# EAGLE design PR04 (EAGLE 6.6.0)
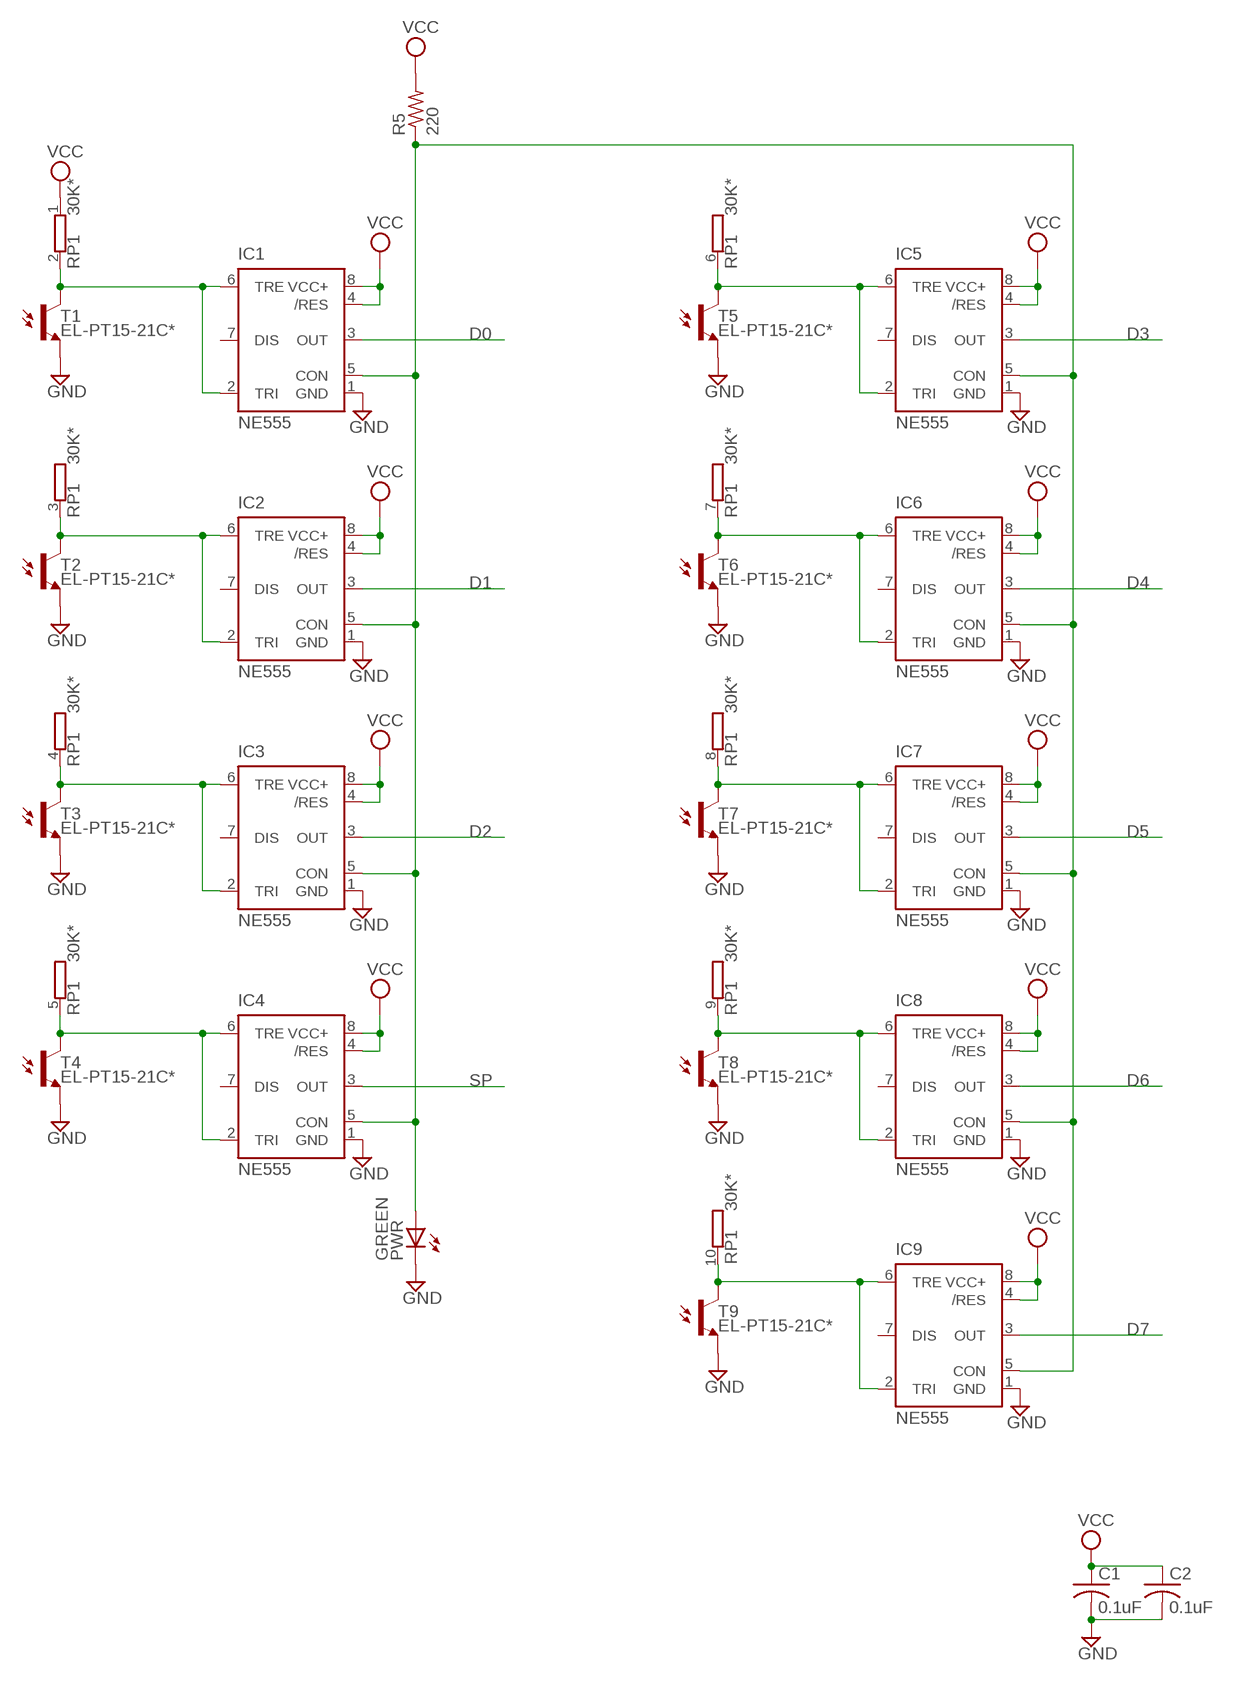
[diagram p0: schematic, sheet 1, part 1 of 2]
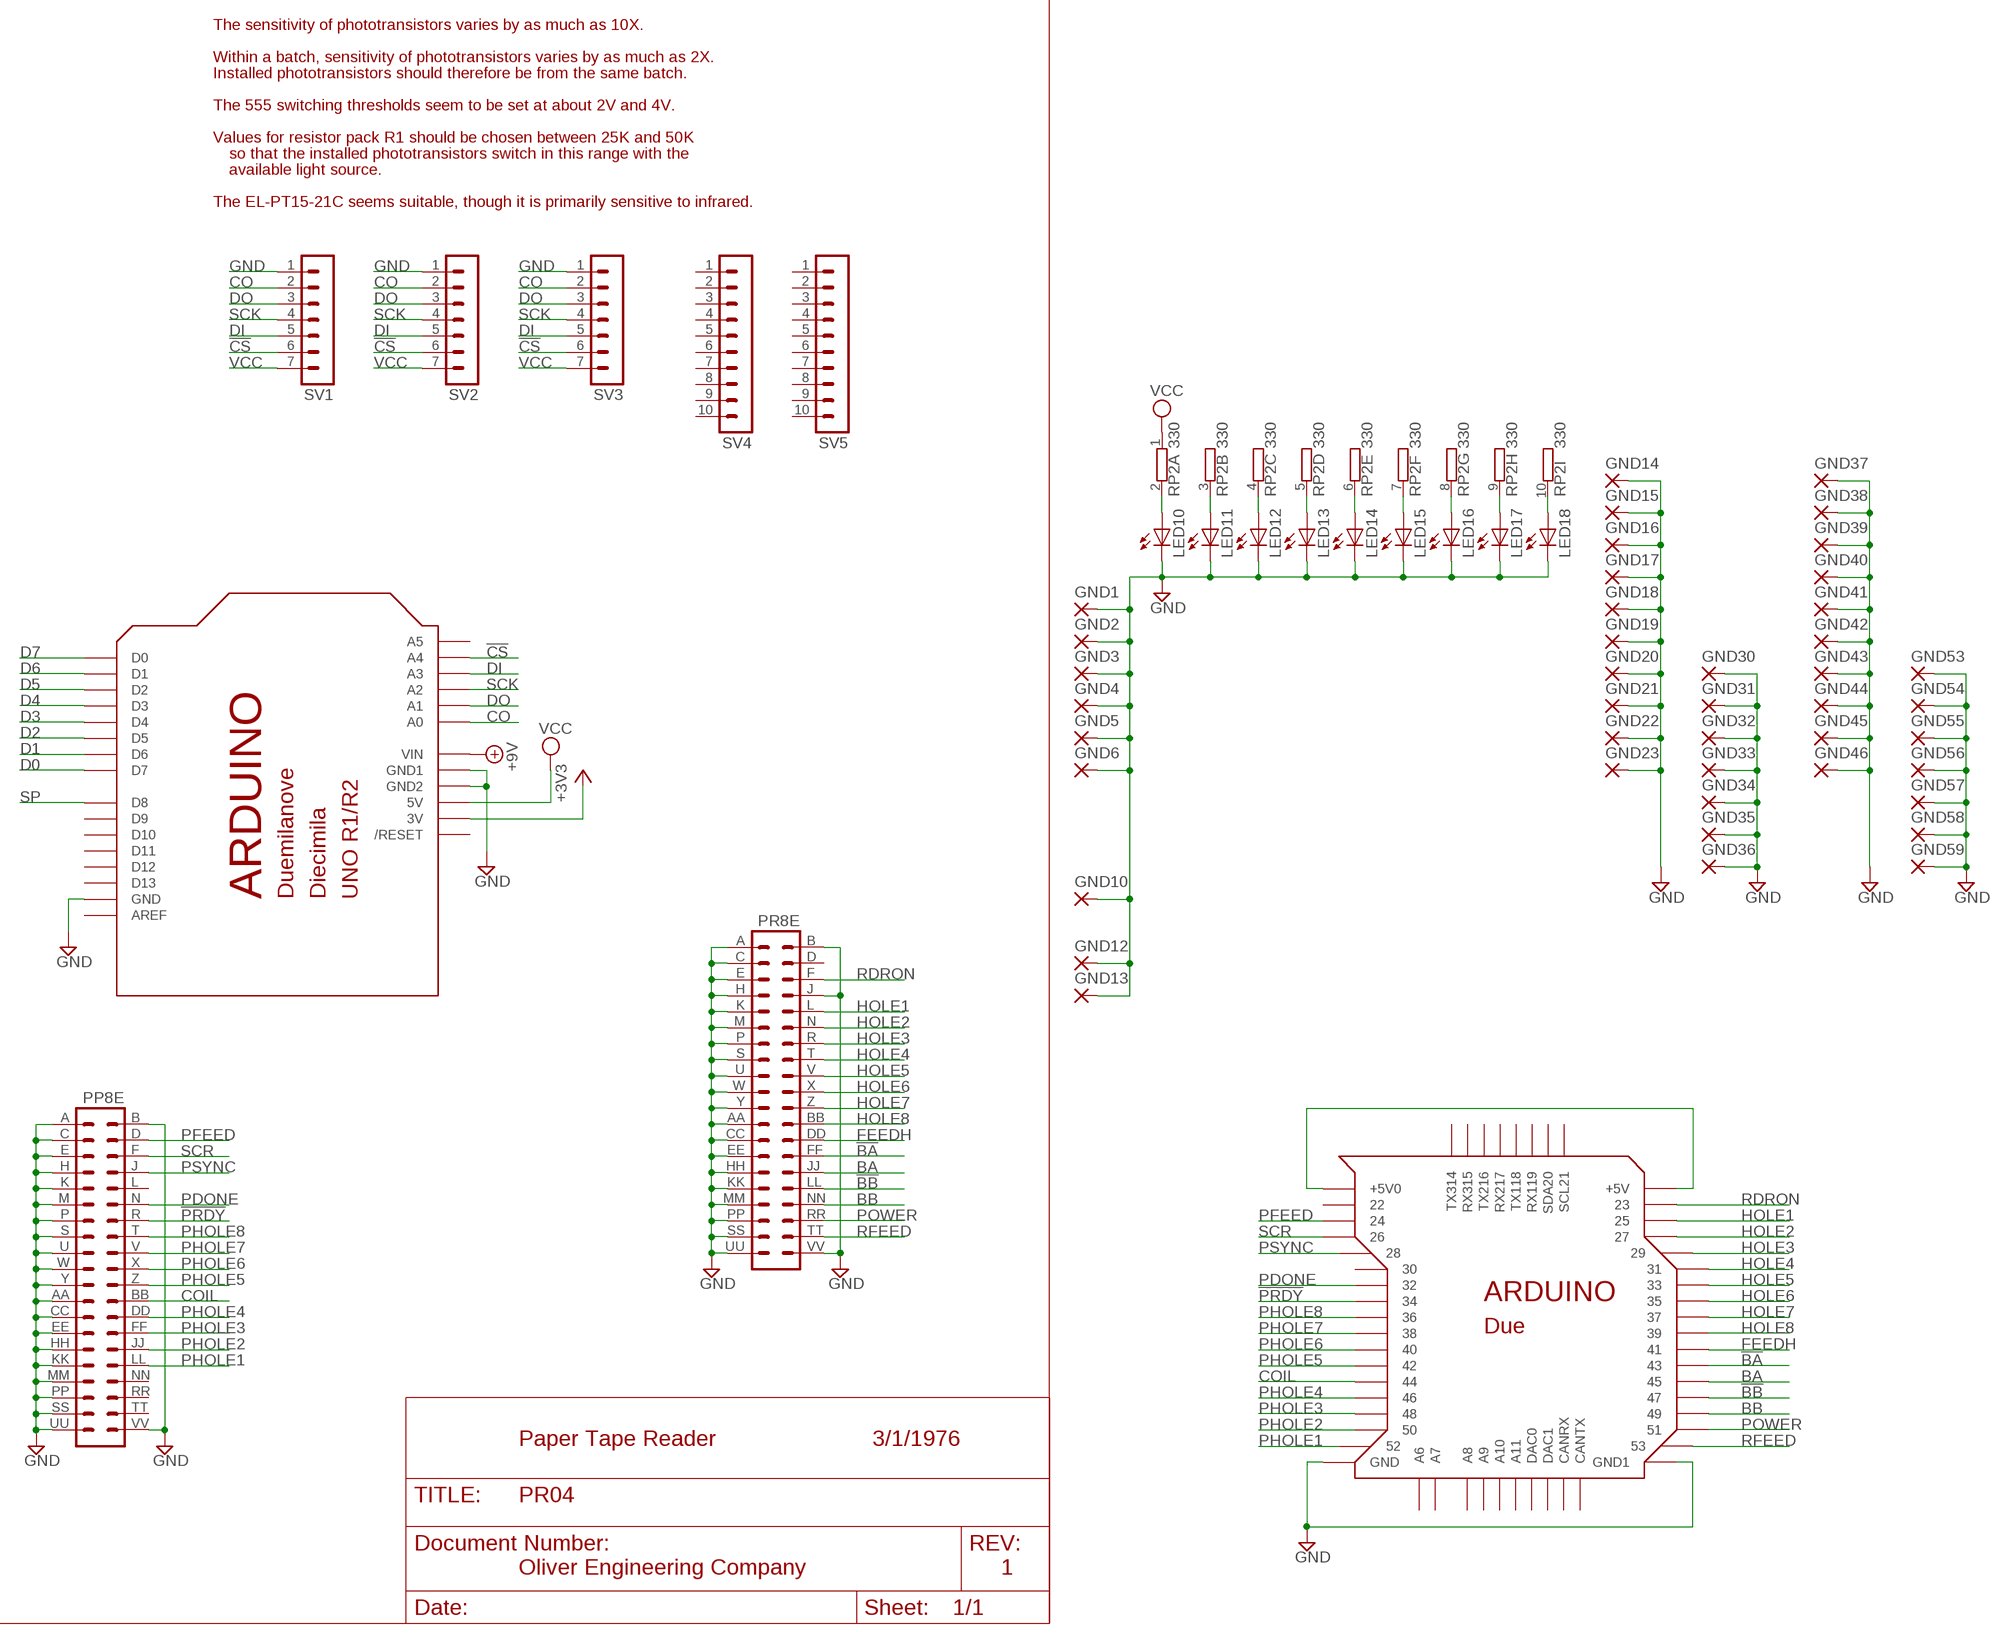
[diagram p1: schematic, sheet 1, part 2 of 2]

## Parts
C1  0.1uF  C-US050-030X075  [C050-030X075]
C2  0.1uF  C-US050-030X075  [C050-030X075]
GND1  2,15/1,0  [2,15/1,0]
GND2  2,15/1,0  [2,15/1,0]
GND3  2,15/1,0  [2,15/1,0]
GND4  2,15/1,0  [2,15/1,0]
GND5  2,15/1,0  [2,15/1,0]
GND6  2,15/1,0  [2,15/1,0]
GND10  2,15/1,0  [2,15/1,0]
GND12  2,15/1,0  [2,15/1,0]
GND13  2,15/1,0  [2,15/1,0]
GND14  2,15/1,0  [2,15/1,0]
GND15  2,15/1,0  [2,15/1,0]
GND16  2,15/1,0  [2,15/1,0]
GND17  2,15/1,0  [2,15/1,0]
GND18  2,15/1,0  [2,15/1,0]
GND19  2,15/1,0  [2,15/1,0]
GND20  2,15/1,0  [2,15/1,0]
GND21  2,15/1,0  [2,15/1,0]
GND22  2,15/1,0  [2,15/1,0]
GND23  2,15/1,0  [2,15/1,0]
GND30  2,15/1,0  [2,15/1,0]
GND31  2,15/1,0  [2,15/1,0]
GND32  2,15/1,0  [2,15/1,0]
GND33  2,15/1,0  [2,15/1,0]
GND34  2,15/1,0  [2,15/1,0]
GND35  2,15/1,0  [2,15/1,0]
GND36  2,15/1,0  [2,15/1,0]
GND37  2,15/1,0  [2,15/1,0]
GND38  2,15/1,0  [2,15/1,0]
GND39  2,15/1,0  [2,15/1,0]
GND40  2,15/1,0  [2,15/1,0]
GND41  2,15/1,0  [2,15/1,0]
GND42  2,15/1,0  [2,15/1,0]
GND43  2,15/1,0  [2,15/1,0]
GND44  2,15/1,0  [2,15/1,0]
GND45  2,15/1,0  [2,15/1,0]
GND46  2,15/1,0  [2,15/1,0]
GND53  2,15/1,0  [2,15/1,0]
GND54  2,15/1,0  [2,15/1,0]
GND55  2,15/1,0  [2,15/1,0]
GND56  2,15/1,0  [2,15/1,0]
GND57  2,15/1,0  [2,15/1,0]
GND58  2,15/1,0  [2,15/1,0]
GND59  2,15/1,0  [2,15/1,0]
IC1  NE555  [DIL-08]
IC2  NE555  [DIL-08]
IC3  NE555  [DIL-08]
IC4  NE555  [DIL-08]
IC5  NE555  [DIL-08]
IC6  NE555  [DIL-08]
IC7  NE555  [DIL-08]
IC8  NE555  [DIL-08]
IC9  NE555  [DIL-08]
LED10  LEDCHIPLED_1206  [CHIPLED_1206]
LED11  LEDCHIPLED_1206  [CHIPLED_1206]
LED12  LEDCHIPLED_1206  [CHIPLED_1206]
LED13  LEDCHIPLED_1206  [CHIPLED_1206]
LED14  LEDCHIPLED_1206  [CHIPLED_1206]
LED15  LEDCHIPLED_1206  [CHIPLED_1206]
LED16  LEDCHIPLED_1206  [CHIPLED_1206]
LED17  LEDCHIPLED_1206  [CHIPLED_1206]
LED18  LEDCHIPLED_1206  [CHIPLED_1206]
PP8E  DEC40PINV  [DEC40PINV]
PR8E  DEC40PINV  [DEC40PINV]
PWR  GREEN  LED3MM  [LED3MM]
R5  220  R-US_0207/10  [0207/10]
RP1  30K*  GE09RP  [SIL10]
RP2  330  GE09R  [SIL10]
SV1  MA07-1  [MA07-1]
SV2  MA07-1  [MA07-1]
SV3  MA07-1  [MA07-1]
SV4  MA10-1  [MA10-1]
SV5  MA10-1  [MA10-1]
T1  EL-PT15-21C*  PHOTOTRANSISTOR  [CHIPLED_1206]
T2  EL-PT15-21C*  PHOTOTRANSISTOR  [CHIPLED_1206]
T3  EL-PT15-21C*  PHOTOTRANSISTOR  [CHIPLED_1206]
T4  EL-PT15-21C*  PHOTOTRANSISTOR  [CHIPLED_1206]
T5  EL-PT15-21C*  PHOTOTRANSISTOR  [CHIPLED_1206]
T6  EL-PT15-21C*  PHOTOTRANSISTOR  [CHIPLED_1206]
T7  EL-PT15-21C*  PHOTOTRANSISTOR  [CHIPLED_1206]
T8  EL-PT15-21C*  PHOTOTRANSISTOR  [CHIPLED_1206]
T9  EL-PT15-21C*  PHOTOTRANSISTOR  [CHIPLED_1206]
U$2  ARDUINO-X  [ARDUINO_DUE_SHIELD]

## Nets
!BA: PR8E.FF U$2.43
!BB: PR8E.LL U$2.47
!CS: SV1.6 SV2.6 SV3.6 U$2.A4
!PRDY: PP8E.R U$2.34
+3V3: U$2.3V3(3V)
+5V: U$2.5V0_1(+5V) U$2.5V0_2(+5V0)
+9V: U$2.VIN
BA: PR8E.JJ U$2.45
BB: PR8E.NN U$2.49
CO: SV1.2 SV2.2 SV3.2 U$2.A0
COIL: PP8E.BB U$2.44
D0: IC1.3(OUT) U$2.7(D7)
D1: IC2.3(OUT) U$2.6(D6)
D2: IC3.3(OUT) U$2.5(D5)
D3: IC5.3(OUT) U$2.4(D4)
D4: IC6.3(OUT) U$2.3(D3)
D5: IC7.3(OUT) U$2.2(D2)
D6: IC8.3(OUT) U$2.1(D1)
D7: IC9.3(OUT) U$2.0(D0)
DI: SV1.5 SV2.5 SV3.5 U$2.A3
DO: SV1.3 SV2.3 SV3.3 U$2.A1
FEEDH: PR8E.DD U$2.41
GND [supply]: C1.2 C2.2 GND1.1(P) GND2.1(P) GND3.1(P) GND4.1(P) GND5.1(P) GND6.1(P) GND10.1(P) GND12.1(P) GND13.1(P) GND14.1(P) GND15.1(P) GND16.1(P) GND17.1(P) GND18.1(P) GND19.1(P) GND20.1(P) GND21.1(P) GND22.1(P) GND23.1(P) GND30.1(P) GND31.1(P) GND32.1(P) GND33.1(P) GND34.1(P) GND35.1(P) GND36.1(P) GND37.1(P) GND38.1(P) GND39.1(P) GND40.1(P) GND41.1(P) GND42.1(P) GND43.1(P) GND44.1(P) GND45.1(P) GND46.1(P) GND53.1(P) GND54.1(P) GND55.1(P) GND56.1(P) GND57.1(P) GND58.1(P) GND59.1(P) IC1.1(GND) IC2.1(GND) IC3.1(GND) IC4.1(GND) IC5.1(GND) IC6.1(GND) IC7.1(GND) IC8.1(GND) IC9.1(GND) LED10.C LED11.C LED12.C LED13.C LED14.C LED15.C LED16.C LED17.C LED18.C PP8E.A PP8E.AA PP8E.B PP8E.C PP8E.CC PP8E.E PP8E.EE PP8E.H PP8E.HH PP8E.K PP8E.KK PP8E.M PP8E.MM PP8E.P PP8E.PP PP8E.S PP8E.SS PP8E.U PP8E.UU PP8E.VV PP8E.W PP8E.Y PR8E.A PR8E.AA PR8E.B PR8E.C PR8E.CC PR8E.E PR8E.EE PR8E.H PR8E.HH PR8E.J PR8E.K PR8E.KK PR8E.M PR8E.MM PR8E.P PR8E.PP PR8E.S PR8E.SS PR8E.U PR8E.UU PR8E.VV PR8E.W PR8E.Y PWR.K(C) SV1.1 SV2.1 SV3.1 T1.C(E) T2.C(E) T3.C(E) T4.C(E) T5.C(E) T6.C(E) T7.C(E) T8.C(E) T9.C(E) U$2.GND U$2.GND_1(GND1) U$2.GND_2(GND2) U$2.GND_3(GND) U$2.GND_4(GND1)
HOLE1: PR8E.L U$2.25
HOLE2: PR8E.N U$2.27
HOLE3: PR8E.R U$2.29
HOLE4: PR8E.T U$2.31
HOLE5: PR8E.V U$2.33
HOLE6: PR8E.X U$2.35
HOLE7: PR8E.Z U$2.37
HOLE8: PR8E.BB U$2.39
N$1: IC1.2(TRI) IC1.6(TRE) RP1.2 T1.A(C)
N$3: IC1.5(CON) IC2.5(CON) IC3.5(CON) IC4.5(CON) IC5.5(CON) IC6.5(CON) IC7.5(CON) IC8.5(CON) IC9.5(CON) PWR.A R5.1
N$4: IC2.2(TRI) IC2.6(TRE) RP1.3 T2.A(C)
N$7: IC3.2(TRI) IC3.6(TRE) RP1.4 T3.A(C)
N$9: IC9.2(TRI) IC9.6(TRE) RP1.10 T9.A(C)
N$10: IC4.2(TRI) IC4.6(TRE) RP1.5 T4.A(C)
N$12: LED10.A RP2.2
N$13: IC5.2(TRI) IC5.6(TRE) RP1.6 T5.A(C)
N$14: LED13.A RP2.5
N$15: IC6.2(TRI) IC6.6(TRE) RP1.7 T6.A(C)
N$17: IC7.2(TRI) IC7.6(TRE) RP1.8 T7.A(C)
N$19: IC8.2(TRI) IC8.6(TRE) RP1.9 T8.A(C)
N$32: LED16.A RP2.8
N$33: LED18.A RP2.10
N$36: LED17.A RP2.9
N$37: LED15.A RP2.7
N$38: LED14.A RP2.6
N$39: LED12.A RP2.4
N$40: LED11.A RP2.3
PDONE: PP8E.N U$2.32
PFEED: PP8E.D U$2.24
PHOLE1: PP8E.LL U$2.52
PHOLE2: PP8E.JJ U$2.50
PHOLE3: PP8E.FF U$2.48
PHOLE4: PP8E.DD U$2.46
PHOLE5: PP8E.Z U$2.42
PHOLE6: PP8E.X U$2.40
PHOLE7: PP8E.V U$2.38
PHOLE8: PP8E.T U$2.36
POWER: PR8E.RR U$2.51
PSYNC: PP8E.J U$2.28
RDRON: PR8E.F U$2.23
RFEED: PR8E.TT U$2.53
SCK: SV1.4 SV2.4 SV3.4 U$2.A2
SCR: PP8E.F U$2.26
SP: IC4.3(OUT) U$2.8(D8)
VCC [supply]: C1.1 C2.1 IC1.4(/RES) IC1.8(VCC+) IC2.4(/RES) IC2.8(VCC+) IC3.4(/RES) IC3.8(VCC+) IC4.4(/RES) IC4.8(VCC+) IC5.4(/RES) IC5.8(VCC+) IC6.4(/RES) IC6.8(VCC+) IC7.4(/RES) IC7.8(VCC+) IC8.4(/RES) IC8.8(VCC+) IC9.4(/RES) IC9.8(VCC+) R5.2 RP1.1 RP2.1 SV1.7 SV2.7 SV3.7 U$2.5V0(5V)
Unconnected: IC1.7(DIS) IC2.7(DIS) IC3.7(DIS) IC4.7(DIS) IC5.7(DIS) IC6.7(DIS) IC7.7(DIS) IC8.7(DIS) IC9.7(DIS) PP8E.L PP8E.NN PP8E.RR PP8E.TT PR8E.D SV4.1 SV4.2 SV4.3 SV4.4 SV4.5 SV4.6 SV4.7 SV4.8 SV4.9 SV4.10 SV5.1 SV5.2 SV5.3 SV5.4 SV5.5 SV5.6 SV5.7 SV5.8 SV5.9 SV5.10 U$2.9(D9) U$2.10(D10) U$2.11(D11) U$2.12(D12) U$2.13(D13) U$2.14(TX314) U$2.15(RX315) U$2.16(TX216) U$2.17(RX217) U$2.18(TX118) U$2.19(RX119) U$2.20(SDA20) U$2.21(SCL21) U$2.22 U$2.30 U$2.A5 U$2.A6 U$2.A7 U$2.A8 U$2.A9 U$2.A10 U$2.A11 U$2.AREF U$2.CANRX U$2.CANTX U$2.DAC0 U$2.DAC1 U$2.RESET(/RESET)

## Notes on the sheet
- The sensitivity of phototransistors varies by as much as 10X.
- Within a batch, sensitivity of phototransistors varies by as much as 2X.
- Installed phototransistors should therefore be from the same batch.
- The 555 switching thresholds seem to be set at about 2V and 4V.
- Values for resistor pack R1 should be chosen between 25K and 50K
- so that the installed phototransistors switch in this range with the
- available light source.
- The EL-PT15-21C seems suitable, though it is primarily sensitive to infrared.
- Paper Tape Reader | 3/1/1976
- Oliver Engineering Company | 1

## Library data of the parts
C1 C2 = rcl:C-US: CAPACITOR, American symbol
GND1-GND6 GND10 GND12-GND23 GND30-GND46 GND53-GND59 = wirepad:2,15/1,0: THROUGH-HOLE PAD
IC1-IC9 = st-microelectronics:NE555: General purpose bipolar Timer; MF: Arrow Electronics; MPN: NE555N; OC_FARNELL: 1467742; OC_NEWARK: 89K1486
LED10-LED18 = opto:LED: LED OSRAM: - CHIPLED LG R971, LG N971, LY N971, LG Q971, LY Q971, LO R971, LY R971 LH N974, LH R974 LS Q976, LO Q976, LY Q976 LO Q996 - Hyper CHIPLED LW Q18S LB Q993, LB Q99A, LB R99A - SideLED LS A670, LO A670, LY A670, LG A670, LP A670 LB A673, LV A673, LT A673, LW A673 LH A674 LY A675 LS A676, LA A676, LO A676, LY A676, LW A676 LS A679, LY A679, LG A679 - Hyper Micro SIDELED® LS Y876, LA Y876, LO Y876, LY Y876 LT Y87S - SmartLED LW L88C, LW L88S LB L89C, LB L89S, LG L890 LS L89K, LO L89K, LY L89K LS L896, LA L896, LO L896, LY L896 - TOPLED LS T670, LO T670, LY T670, LG T670, LP T670 LSG T670, LSP T670, LSY T670, LOP T670, LYG T670 LG T671, LOG T671, LSG T671 LB T673, LV T673, LT T673, LW T673 LH T674 LS T676, LA T676, LO T676, LY T676, LB T676, LH T676, LSB T676, LW T676 LB T67C, LV T67C, LT T67C, LS T67K, LO T67K, LY T67K, LW E67C LS E67B, LA E67B, LO E67B, LY E67B, LB E67C, LV E67C, LT E67C LW T67C LS T679, LY T679, LG T679 LS T770, LO T770, LY T770, LG T770, LP T770 LB T773, LV T773, LT T773, LW T773 LH T774 LS E675, LA E675, LY E675, LS T675 LS T776, LA T776, LO T776, LY T776, LB T776 LHGB T686 LT T68C, LB T68C - Hyper Mini TOPLED® LB M676 - Mini TOPLED Santana® LG M470 LS M47K, LO M47K, LY M47K Source: http://www.osram.convergy.de LUXEON: - LUMILED® LXK2-PW12-R00, LXK2-PW12-S00, LXK2-PW14-U00, LXK2-PW14-V00 LXK2-PM12-R00, LXK2-PM12-S00, LXK2-PM14-U00 LXK2-PE12-Q00, LXK2-PE12-R00, LXK2-PE12-S00, LXK2-PE14-T00, LXK2-PE14-U00 LXK2-PB12-K00, LXK2-PB12-L00, LXK2-PB12-M00, LXK2-PB14-N00, LXK2-PB14-P00, LXK2-PB14-Q00 LXK2-PR12-L00, LXK2-PR12-M00, LXK2-PR14-Q00, LXK2-PR14-R00 LXK2-PD12-Q00, LXK2-PD12-R00, LXK2-PD12-S00 LXK2-PH12-R00, LXK2-PH12-S00 LXK2-PL12-P00, LXK2-PL12-Q00, LXK2-PL12-R00 Source: www.luxeon.com KINGBRIGHT: KA-3528ASYC Source: www.kingbright.com
PP8E PR8E = dec-con:DEC40PIN: PIN HEADER
PWR = led:LED: LED OSRAM: - CHIPLED LG R971, LG N971, LY N971, LG Q971, LY Q971, LO R971, LY R971 LH N974, LH R974 LS Q976, LO Q976, LY Q976 LO Q996 - Hyper CHIPLED LW Q18S LB Q993, LB Q99A, LB R99A - SideLED LS A670, LO A670, LY A670, LG A670, LP A670 LB A673, LV A673, LT A673, LW A673 LH A674 LY A675 LS A676, LA A676, LO A676, LY A676, LW A676 LS A679, LY A679, LG A679 - Hyper Micro SIDELED® LS Y876, LA Y876, LO Y876, LY Y876 LT Y87S - SmartLED LW L88C, LW L88S LB L89C, LB L89S, LG L890 LS L89K, LO L89K, LY L89K LS L896, LA L896, LO L896, LY L896 - TOPLED LS T670, LO T670, LY T670, LG T670, LP T670 LSG T670, LSP T670, LSY T670, LOP T670, LYG T670 LG T671, LOG T671, LSG T671 LB T673, LV T673, LT T673, LW T673 LH T674 LS T676, LA T676, LO T676, LY T676, LB T676, LH T676, LSB T676, LW T676 LB T67C, LV T67C, LT T67C, LS T67K, LO T67K, LY T67K, LW E67C LS E67B, LA E67B, LO E67B, LY E67B, LB E67C, LV E67C, LT E67C LW T67C LS T679, LY T679, LG T679 LS T770, LO T770, LY T770, LG T770, LP T770 LB T773, LV T773, LT T773, LW T773 LH T774 LS E675, LA E675, LY E675, LS T675 LS T776, LA T776, LO T776, LY T776, LB T776 LHGB T686 LT T68C, LB T68C - Hyper Mini TOPLED® LB M676 - Mini TOPLED Santana® LG M470 LS M47K, LO M47K, LY M47K Source: http://www.osram.convergy.de LUXEON: - LUMILED® LXK2-PW12-R00, LXK2-PW12-S00, LXK2-PW14-U00, LXK2-PW14-V00 LXK2-PM12-R00, LXK2-PM12-S00, LXK2-PM14-U00 LXK2-PE12-Q00, LXK2-PE12-R00, LXK2-PE12-S00, LXK2-PE14-T00, LXK2-PE14-U00 LXK2-PB12-K00, LXK2-PB12-L00, LXK2-PB12-M00, LXK2-PB14-N00, LXK2-PB14-P00, LXK2-PB14-Q00 LXK2-PR12-L00, LXK2-PR12-M00, LXK2-PR14-Q00, LXK2-PR14-R00 LXK2-PD12-Q00, LXK2-PD12-R00, LXK2-PD12-S00 LXK2-PH12-R00, LXK2-PH12-S00 LXK2-PL12-P00, LXK2-PL12-Q00, LXK2-PL12-R00 Source: www.luxeon.com KINGBRIGHT: KA-3528ASYC Source: www.kingbright.com
R5 = rcl:R-US_: RESISTOR, American symbol
RP1 = resistor-sil:GE09RP: SIL RESISTOR; OC_FARNELL: unknown; OC_NEWARK: unknown
RP2 = resistor-sil:GE09R: SIL RESISTOR; OC_FARNELL: unknown; OC_NEWARK: unknown
SV1-SV3 = con-lstb:MA07-1: PIN HEADER; OC_FARNELL: unknown; OC_NEWARK: unknown
SV4 SV5 = con-lstb:MA10-1: PIN HEADER; OC_FARNELL: unknown; OC_NEWARK: unknown
T1-T9 = opto:PHOTOTRANSISTOR: Phototransistor PT17-21C/L41/TR8 is a phototransistor in miniature SMD package which is molded in a water clear with flat top view lens. The device is Spectrally matched to visible and infrared emitting diode. Datasheet <http://www.everlight.com/file/ProductFile/PT17-21C-L41-TR8.pdf> SparkFun Products: SparkFun Electric Imp imp002 Breakout <https://www.sparkfun.com/products/12958>
U$2 = arduino:ARDUINO-X: Extended Body Arduino

## Net classes
1 supply: width 0.61 mm

## Board
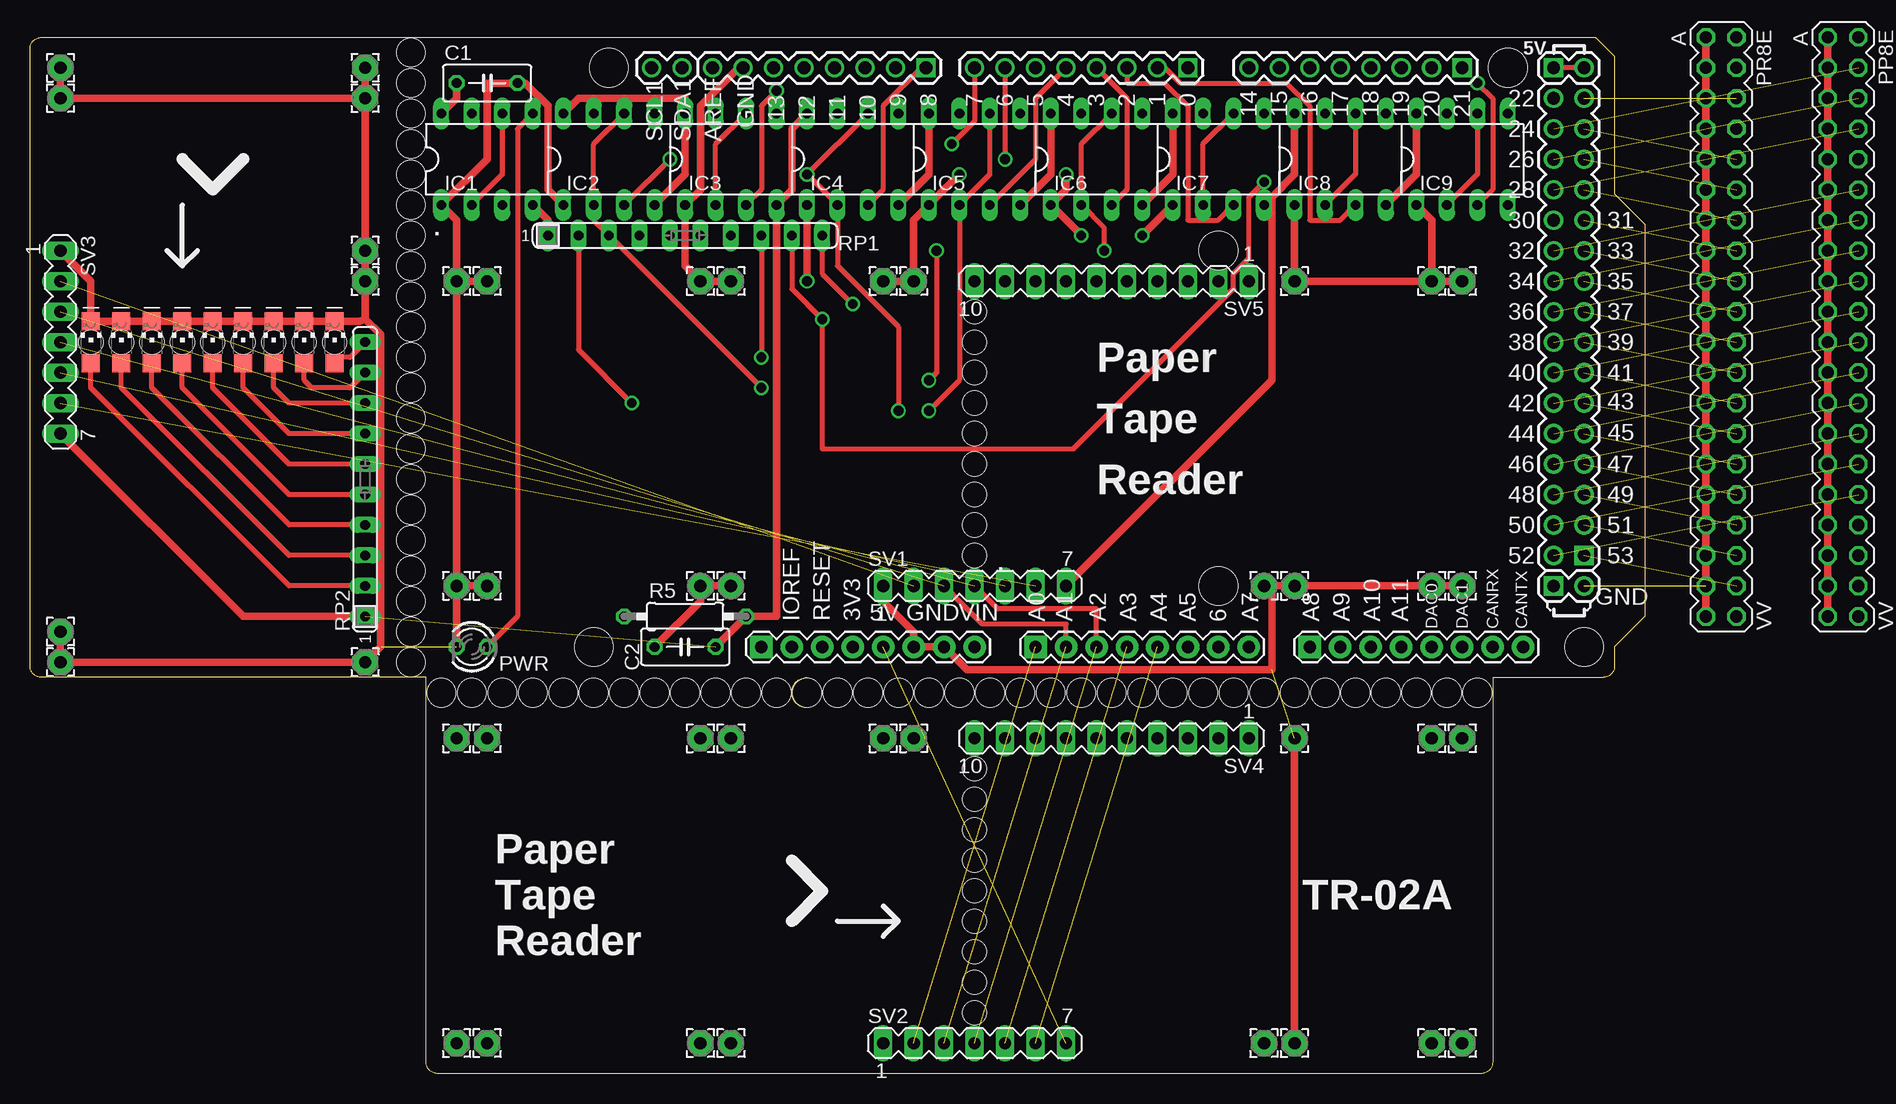
[diagram p2: board, top side]
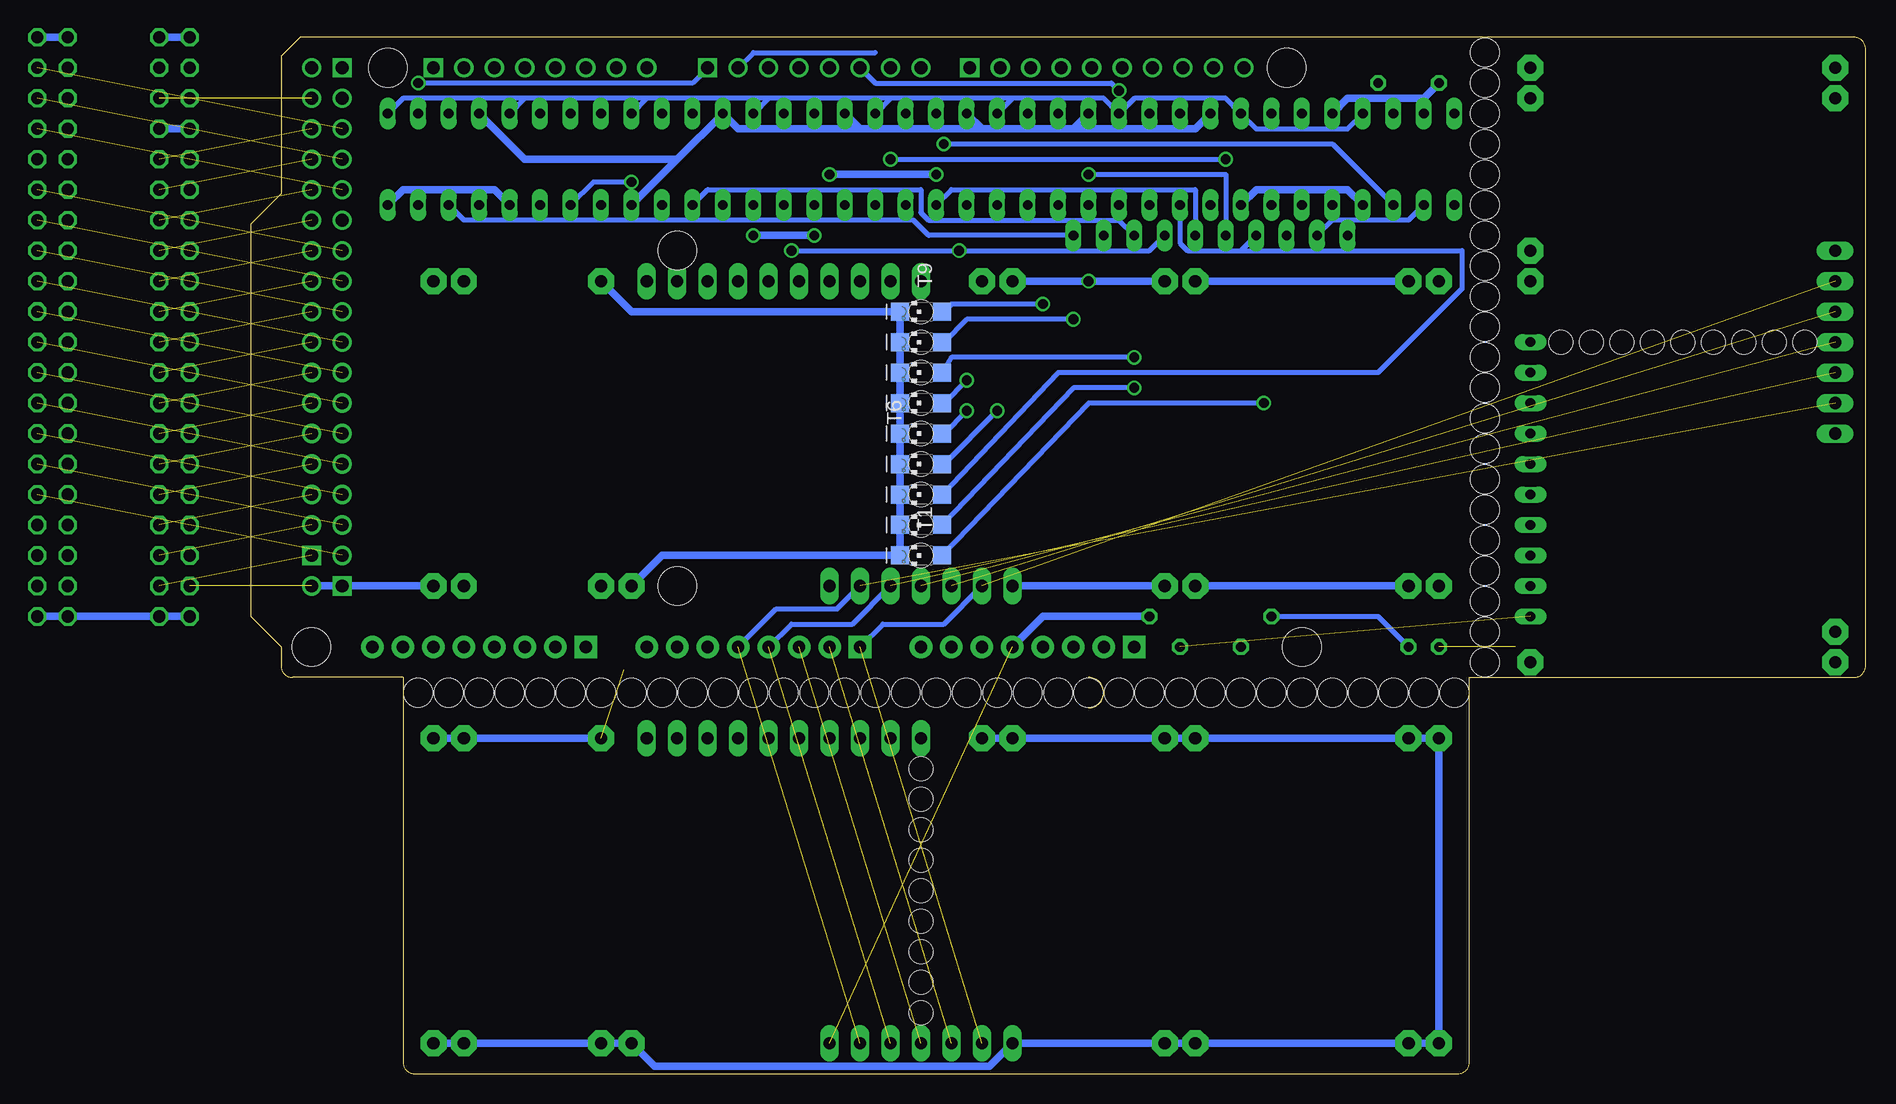
[diagram p3: board, bottom side, seen from below]

Size 134.62 x 86.36 mm. Coordinates in mm from the lower left corner, seen from the top.
Outline: 64.77,30.48 arc-180 64.77,33.02
Outline: 33.02,33.02 0.95,33.02 arc-90 0,33.97 0,85.41 arc-90 0.95,86.36 130.49,86.36 132.08,84.77 132.08,73.34 134.62,70.8 134.62,38.1 132.08,35.56 132.08,33.97 arc-90 131.13,33.02 121.92,33.02 121.92,0.95 arc-90 120.97,0 33.97,0 arc-90 33.02,0.95 33.02,33.02
Copper layers (1+16): Top 0.035mm / dielectric 1.5mm / Bottom 0.035mm
Design rules "16mils *": minimum track width 16mil, minimum drill 32mil, track to track 15mil, track to pad 10mil, pad to pad 10mil, via to via 10mil, smd to smd 10mil, copper to edge 0mil, drill to drill 6mil, minimum pad ring 10mil, minimum via ring 8mil, stop-mask expansion 0mil, vias tented up to drill 0mil, thermal gap 10mil
Holes 2 mm at 25.4,60.96 22.86,60.96 20.32,60.96 17.78,60.96 15.24,60.96 12.7,60.96 10.16,60.96 7.62,60.96 5.08,60.96 78.74,5.08 78.74,7.62 78.74,10.16 78.74,12.7 78.74,15.24 78.74,17.78 78.74,20.32 78.74,22.86 78.74,25.4 78.74,43.18 78.74,45.72 78.74,48.26 78.74,50.8 78.74,53.34 78.74,55.88 78.74,58.42 78.74,60.96 78.74,63.5
Holes 2.38 mm at 31.75,34.29 31.75,36.83 31.75,39.37 31.75,41.91 31.75,44.45 31.75,46.99 31.75,49.53 31.75,52.07 31.75,54.61 31.75,57.15 31.75,59.69 31.75,85.09 31.75,82.55 31.75,80.01 31.75,77.47 31.75,74.93 31.75,72.39 31.75,69.85 31.75,67.31 31.75,64.77 31.75,62.23 85.09,31.75 82.55,31.75 80.01,31.75 77.47,31.75 74.93,31.75 72.39,31.75 69.85,31.75 67.31,31.75 64.77,31.75 62.23,31.75 59.69,31.75 34.29,31.75 36.83,31.75 39.37,31.75 41.91,31.75 44.45,31.75 46.99,31.75 49.53,31.75 52.07,31.75 54.61,31.75 57.15,31.75 120.65,31.75 118.11,31.75 115.57,31.75 113.03,31.75 87.63,31.75 90.17,31.75 92.71,31.75 95.25,31.75 97.79,31.75 100.33,31.75 102.87,31.75 105.41,31.75 107.95,31.75 110.49,31.75

### Footprints (pad centres in the part's own frame; a part is rotated, then mirrored left to right if it is on the bottom)
C050-030X075 = drill 0.813 octagon: 1 -2.54,0; 2 2.54,0
2,15/1,0 = drill 1.016 pad 2.159 octagon: 1 0,0
DIL-08 = drill 0.813 long: 1 -3.81,-3.81; 2 -1.27,-3.81; 3 1.27,-3.81; 4 3.81,-3.81; 5 3.81,3.81; 6 1.27,3.81; 7 -1.27,3.81; 8 -3.81,3.81
CHIPLED_1206 = smd 1.5 x 1.5: A 0,-1.75; C 0,1.75
DEC40PINV = drill 1.016 octagon: A -24.13,-1.27; AA 3.81,-1.27; B -24.13,1.27; BB 3.81,1.27; C -21.59,-1.27; CC 6.35,-1.27; D -21.59,1.27; DD 6.35,1.27; E -19.05,-1.27; EE 8.89,-1.27; F -19.05,1.27; FF 8.89,1.27; H -16.51,-1.27; HH 11.43,-1.27; J -16.51,1.27; JJ 11.43,1.27; K -13.97,-1.27; KK 13.97,-1.27; L -13.97,1.27; LL 13.97,1.27; M -11.43,-1.27; MM 16.51,-1.27; N -11.43,1.27; NN 16.51,1.27; P -8.89,-1.27; PP 19.05,-1.27; R -8.89,1.27; RR 19.05,1.27; S -6.35,-1.27; SS 21.59,-1.27; T -6.35,1.27; TT 21.59,1.27; U -3.81,-1.27; UU 24.13,-1.27; V -3.81,1.27; VV 24.13,1.27; W -1.27,-1.27; X -1.27,1.27; Y 1.27,-1.27; Z 1.27,1.27
LED3MM = drill 0.813 octagon: A -1.27,0; K 1.27,0
0207/10 = drill 0.813 octagon: 1 -5.08,0; 2 5.08,0
SIL10 = drill 0.813 long: 1 -11.43,0; 2 -8.89,0; 3 -6.35,0; 4 -3.81,0; 5 -1.27,0; 6 1.27,0; 7 3.81,0; 8 6.35,0; 9 8.89,0; 10 11.43,0
MA07-1 = drill 1.016 long: 1 -7.62,0; 2 -5.08,0; 3 -2.54,0; 4 0,0; 5 2.54,0; 6 5.08,0; 7 7.62,0
MA10-1 = drill 1.016 long: 1 -11.43,0; 2 -8.89,0; 3 -6.35,0; 4 -3.81,0; 5 -1.27,0; 6 1.27,0; 7 3.81,0; 8 6.35,0; 9 8.89,0; 10 11.43,0
ARDUINO_DUE_SHIELD = drill 1.067 square: 0 63.5,50.8; 5V0_1 93.98,50.8; 8 41.656,50.8; 21 86.36,50.8; 53 96.52,10.16; GND_4 93.98,7.62 | drill 1.067: 1 60.96,50.8; 2 58.42,50.8; 3 55.88,50.8; 4 53.34,50.8; 5 50.8,50.8; 5V0_2 96.52,50.8; 6 48.26,50.8; 7 45.72,50.8; 9 39.116,50.8; 10 36.576,50.8; 11 34.036,50.8; 12 31.496,50.8; 13 28.956,50.8; 14 68.58,50.8; 15 71.12,50.8; 16 73.66,50.8; 17 76.2,50.8; 18 78.74,50.8; 19 81.28,50.8; 20 83.82,50.8; 22 93.98,48.26; 23 96.52,48.26; 24 93.98,45.72; 25 96.52,45.72; 26 93.98,43.18; 27 96.52,43.18; 28 93.98,40.64; 29 96.52,40.64; 30 93.98,38.1; 31 96.52,38.1; 32 93.98,35.56; 33 96.52,35.56; 34 93.98,33.02; 35 96.52,33.02; 36 93.98,30.48; 37 96.52,30.48; 38 93.98,27.94; 39 96.52,27.94; 40 93.98,25.4; 41 96.52,25.4; 42 93.98,22.86; 43 96.52,22.86; 44 93.98,20.32; 45 96.52,20.32; 46 93.98,17.78; 47 96.52,17.78; 48 93.98,15.24; 49 96.52,15.24; 50 93.98,12.7; 51 96.52,12.7; 52 93.98,10.16; AREF 23.876,50.8; GND_2 26.416,50.8; GND_3 96.52,7.62; SCL1 18.796,50.8; SDA1 21.336,50.8 | drill 1.016 pad 1.88: 3V3 35.56,2.54; 5V0 38.1,2.54; A1 53.34,2.54; A2 55.88,2.54; A3 58.42,2.54; A4 60.96,2.54; A5 63.5,2.54; A6 66.04,2.54; A7 68.58,2.54; A9 76.2,2.54; A10 78.74,2.54; A11 81.28,2.54; CANRX 88.9,2.54; CANTX 91.44,2.54; DAC0 83.82,2.54; DAC1 86.36,2.54; GND 40.64,2.54; GND_1 43.18,2.54; IOREF 30.48,2.54; RESET 33.02,2.54; VIN 45.72,2.54 | drill 1.016 pad 1.88 square: A0 50.8,2.54; A8 73.66,2.54; NC_2 27.94,2.54 | hole 3.2: 96.52,2.54; 15.24,50.8; 90.17,50.8; 13.97,2.54; 66.04,35.56; 66.04,7.62

### Placement (x,y rotation side)
C1  38.1,82.55 0 top
C2  54.61,35.56 180 top
GND1  2.54,83.82 0 top
GND2  27.94,83.82 0 top
GND3  2.54,81.28 0 top
GND4  27.94,81.28 0 top
GND5  27.94,68.58 0 top
GND6  27.94,66.04 0 top
GND10  2.54,36.83 0 top
GND12  2.54,34.29 0 top
GND13  27.94,34.29 0 top
GND14  35.56,27.94 0 top
GND15  38.1,27.94 0 top
GND16  35.56,2.54 0 top
GND17  38.1,2.54 0 top
GND18  55.88,27.94 0 top
GND19  58.42,27.94 0 top
GND20  55.88,2.54 0 top
GND21  71.12,27.94 0 top
GND22  73.66,27.94 0 top
GND23  58.42,2.54 0 top
GND30  105.41,27.94 0 top
GND31  102.87,2.54 0 top
GND32  105.41,2.54 0 top
GND33  116.84,27.94 0 top
GND34  119.38,27.94 0 top
GND35  116.84,2.54 0 top
GND36  119.38,2.54 0 top
GND37  35.56,66.04 0 top
GND38  38.1,66.04 0 top
GND39  35.56,40.64 0 top
GND40  38.1,40.64 0 top
GND41  55.88,66.04 0 top
GND42  58.42,66.04 0 top
GND43  55.88,40.64 0 top
GND44  58.42,40.64 0 top
GND45  71.12,66.04 0 top
GND46  73.66,66.04 0 top
GND53  105.41,66.04 0 top
GND54  102.87,40.64 0 top
GND55  105.41,40.64 0 top
GND56  116.84,66.04 0 top
GND57  119.38,66.04 0 top
GND58  116.84,40.64 0 top
GND59  119.38,40.64 0 top
IC1  38.1,76.2 0 top
IC2  48.26,76.2 0 top
IC3  58.42,76.2 0 top
IC4  68.58,76.2 0 top
IC5  78.74,76.2 0 top
IC6  88.9,76.2 0 top
IC7  99.06,76.2 0 top
IC8  109.22,76.2 0 top
IC9  119.38,76.2 0 top
LED10  5.08,60.96 0 top
LED11  7.62,60.96 0 top
LED12  10.16,60.96 0 top
LED13  12.7,60.96 0 top
LED14  15.24,60.96 0 top
LED15  17.78,60.96 0 top
LED16  20.32,60.96 0 top
LED17  22.86,60.96 0 top
LED18  25.4,60.96 0 top
PP8E  151.13,62.23 270 top  (outside the outline)
PR8E  140.97,62.23 270 top  (outside the outline)
PWR  36.83,35.56 180 top
R5  54.61,38.1 0 top
RP1  54.61,69.85 0 top
RP2  27.94,49.53 90 top
SV1  78.74,40.64 0 top
SV2  78.74,2.54 0 top
SV3  2.54,60.96 270 top
SV4  90.17,27.94 180 top
SV5  90.17,66.04 180 top
T1  78.74,43.18 90 bottom
T2  78.74,45.72 90 bottom
T3  78.74,48.26 90 bottom
T4  78.74,50.8 90 bottom
T5  78.74,53.34 90 bottom
T6  78.74,55.88 90 bottom
T7  78.74,58.42 90 bottom
T8  78.74,60.96 90 bottom
T9  78.74,63.5 90 bottom
U$2  33.02,33.02 0 top

### Tracks (layer width: path | path; a pad name or v marks a point on that pad's centre or on a via)
!BA  (1 unrouted)
!BB  (1 unrouted)
!CS  (2 unrouted)
  Bottom 0.406: SV1.6 85.72,38.73 90.81,38.73 U$2.A4
!PRDY  (1 unrouted)
+5V
  Top 0.406: U$2.5V0_2 U$2.5V0_1
BA  (1 unrouted)
BB  (1 unrouted)
CO  (2 unrouted)
  Bottom 0.406: SV1.2 76.84,37.47 81.92,37.47 U$2.A0
COIL  (1 unrouted)
D0  (via drill 0.81)
  Top 0.406: v76.84,77.47 78.74,79.38 U$2.7
  Bottom 0.406: IC1.3 44.45,77.47 v76.84,77.47
D1  (via drill 0.81)
  Top 0.406: v53.34,76.2 IC2.3 | U$2.6 v81.28,76.2
  Bottom 0.406: v81.28,76.2 v53.34,76.2
D2  (via drill 0.81)
  Top 0.406: IC3.3 60.96,73.66 60.96,80.65 v62.23,81.92
  Bottom 0.406: v62.23,81.92 62.87,82.55 82.55,82.55 U$2.5
D3
  Top 0.406: IC5.3 83.82,76.2 83.82,81.28 U$2.4
D4
  Top 0.406: IC6.3 91.44,73.66 91.44,81.28 U$2.3
D5
  Top 0.406: IC7.3 99.06,71.12 96.52,71.12 96.52,80.65 94.62,82.55 91.44,82.55 U$2.2
D6
  Top 0.406: IC8.3 109.22,71.12 106.68,71.12 106.68,80.65 104.78,82.55 95.89,82.55 94.62,83.82 U$2.1
  Bottom 0.406: 82.55,85.09 92.71,85.09 U$2.1
D7  (via drill 0.81)
  Top 0.406: IC9.3 121.92,73.66 121.92,81.28 v120.65,82.55
  Bottom 0.406: v120.65,82.55 97.79,82.55 U$2.0
DI  (2 unrouted)
  Bottom 0.406: SV1.5 84.46,37.47 89.53,37.47 U$2.A3
DO  (2 unrouted)
  Top 0.406: SV1.3 79.38,37.47 86.36,37.47 U$2.A1
FEEDH  (1 unrouted)
GND  (via drill 0.81)  (3 unrouted)
  Top 0.61: 27.94,62.87 GND6.1 GND5.1 GND4.1 | 27.94,62.87 27.46,62.71 LED18.C LED17.C LED16.C LED15.C LED14.C LED13.C LED12.C LED11.C LED10.C 5.08,66.04 SV3.1 | GND1.1 GND3.1 GND4.1 | GND2.1 GND4.1 | GND10.1 GND12.1 GND13.1 29.21,35.56 29.21,61.59 27.94,62.87 | GND39.1 PWR.K | GND39.1 GND40.1 | C2.2 55.88,39.37 GND43.1 GND44.1 | v64.77,66.04 IC4.1 | IC2.1 43.18,73.66 43.18,80.65 41.28,82.55 C1.2 38.1,82.55 38.1,76.2 IC1.1 35.56,71.12 GND37.1 | GND37.1 GND38.1 | U$2.GND_2 59.06,83.82 55.88,80.65 55.88,73.66 IC3.1 54.61,67.31 GND41.1 GND42.1 | IC9.1 116.84,71.12 GND56.1 | GND56.1 GND57.1 | IC8.1 GND53.1 GND56.1 | 103.5,40.64 GND55.1 GND58.1 GND59.1 | GND45.1 GND46.1 73.66,71.12 IC5.1 v77.47,74.93 | GND37.1 GND39.1 | SV1.1 71.12,39.37 73.66,36.83 U$2.GND U$2.GND_1 78.11,33.66 103.5,33.66 103.5,40.64 | GND32.1 GND30.1 | v87.63,69.85 IC6.1 86.36,73.66 v86.36,74.93 | IC7.1 v92.71,69.85 | 103.5,40.64 GND54.1 | PR8E.A PR8E.C PR8E.E PR8E.H PR8E.K PR8E.M PR8E.P PR8E.S PR8E.U PR8E.W PR8E.Y PR8E.AA PR8E.CC PR8E.EE PR8E.HH PR8E.KK PR8E.MM PR8E.PP PR8E.SS PR8E.UU | PP8E.A PP8E.C PP8E.E PP8E.H PP8E.K PP8E.M PP8E.P PP8E.S PP8E.U PP8E.W PP8E.Y PP8E.AA PP8E.CC PP8E.EE PP8E.HH PP8E.KK PP8E.MM PP8E.PP PP8E.SS PP8E.UU
  Bottom 0.61: GND36.1 GND35.1 GND32.1 GND31.1 100.97,0.64 73.03,0.64 SV2.1 GND23.1 GND20.1 GND17.1 GND16.1 GND14.1 GND15.1 GND18.1 GND19.1 GND21.1 GND22.1 | GND34.1 GND33.1 GND30.1 | GND43.1 GND40.1 | GND41.1 GND38.1 | GND54.1 100.33,43.18 T1.C T2.C T3.C T4.C T5.C T6.C T7.C T8.C T9.C 102.87,63.5 GND53.1 | GND45.1 v64.77,66.04 GND42.1 | GND44.1 SV1.1 | v92.71,69.85 v87.63,69.85 | v77.47,74.93 v86.36,74.93 | PR8E.A PR8E.B | PR8E.J PR8E.H | PR8E.UU PR8E.VV PP8E.UU PP8E.VV | PP8E.A PP8E.B | U$2.GND_3 U$2.GND_4 GND59.1
HOLE1  (1 unrouted)
HOLE2  (1 unrouted)
HOLE3  (1 unrouted)
HOLE4  (1 unrouted)
HOLE5  (1 unrouted)
HOLE6  (1 unrouted)
HOLE7  (1 unrouted)
HOLE8  (1 unrouted)
N$1  (via drill 0.81)
  Top 0.406: IC1.2 39.37,74.93 IC1.6 | v50.17,55.88 45.72,60.33 RP1.2
  Bottom 0.406: RP1.2 44.45,71.12 38.1,71.12 IC1.2 | T1.A 64.77,55.88 v50.17,55.88
N$3
  Top 0.406: PWR.A 40.64,38.1 40.64,78.74 IC1.5
  Bottom 0.406: PWR.A 40.64,38.1 R5.1 | IC1.5 43.18,78.74 50.8,78.74 IC2.5 53.34,81.28 60.96,81.28 IC3.5 63.5,81.28 71.12,81.28 | 71.12,81.28 IC4.5 | 81.28,81.28 IC5.5 | 71.12,81.28 81.28,81.28 | 91.44,81.28 IC6.5 | 81.28,81.28 91.44,81.28 | 101.6,81.28 IC7.5 | 91.44,81.28 101.6,81.28 | 111.76,81.28 IC8.5 | 101.6,81.28 111.76,81.28 | IC9.5 121.92,81.28 111.76,81.28
N$4  (via drill 0.81)
  Top 0.406: v60.96,57.15 RP1.3 46.99,71.12 IC2.2 46.99,77.47 IC2.6
  Bottom 0.406: T2.A 66.04,57.15 v60.96,57.15
N$7
  Top 0.406: IC3.6 57.15,77.47 IC3.2
  Bottom 0.406: 52.07,68.58 RP1.4 | 52.07,68.58 56.52,68.58 57.15,69.22 IC3.2 | T3.A 67.31,58.42 40.64,58.42 33.66,65.41 33.66,68.58 52.07,68.58
N$9  (via drill 0.81)
  Top 0.406: IC9.2 120.65,74.93 IC9.6 | v68.58,64.14 66.04,66.68 RP1.10
  Bottom 0.406: IC9.2 116.84,71.12 79.38,71.12 78.11,69.85 RP1.10 | v68.58,64.14 76.2,64.14 76.84,63.5 T9.A
N$10  (via drill 0.81)
  Top 0.406: IC4.6 v64.77,74.93 IC4.2 67.31,67.31 72.39,62.23 v72.39,55.25
  Bottom 0.406: RP1.5 53.34,74.93 v64.77,74.93 | v72.39,55.25 76.84,50.8 T4.A
N$12
  Top 0.406: LED10.A 5.08,57.15 21.59,40.64 RP2.2
N$13  (via drill 0.81)
  Top 0.406: IC5.6 80.01,74.93 IC5.2 77.47,57.79 v74.93,55.25
  Bottom 0.406: RP1.6 55.88,73.66 76.2,73.66 IC5.2 | v74.93,55.25 76.84,53.34 T5.A
N$14
  Top 0.406: LED13.A 12.7,57.15 21.59,48.26 RP2.5
N$15  (via drill 0.81)
  Top 0.406: IC6.6 87.63,77.47 IC6.2 89.53,70.49 v89.53,68.58 | v74.93,57.79 75.56,58.42 v75.56,68.58
  Bottom 0.406: T6.A 76.84,55.88 v74.93,57.79 | RP1.7 59.69,68.58 v75.56,68.58 v89.53,68.58
N$17  (via drill 0.81)
  Top 0.406: RP1.8 v60.96,59.69 | IC7.6 97.79,77.47 IC7.2
  Bottom 0.406: RP1.8 62.23,71.12 78.11,71.12 78.74,71.75 78.74,73.66 96.52,73.66 IC7.2 | T7.A 76.2,59.69 v60.96,59.69
N$19  (via drill 0.81)
  Top 0.406: IC8.2 110.49,74.93 IC8.6 | RP1.9 63.5,65.41 v66.04,62.87 66.04,52.07 87,52.07 100.33,65.41 100.33,66.68 101.6,67.94 101.6,73.03 v102.87,74.3
  Bottom 0.406: v66.04,62.87 74.93,62.87 76.84,60.96 T8.A | IC8.2 106.05,74.3 v102.87,74.3
N$32
  Top 0.406: LED16.A 20.32,57.15 21.59,55.88 RP2.8
N$33
  Top 0.406: RP2.10 26.67,59.69 25.4,59.69 LED18.A
N$36
  Top 0.406: RP2.9 26.67,57.15 23.5,57.15 22.86,57.79 LED17.A
N$37
  Top 0.406: LED15.A 17.78,57.15 21.59,53.34 RP2.7
N$38
  Top 0.406: LED14.A 15.24,57.15 21.59,50.8 RP2.6
N$39
  Top 0.406: LED12.A 10.16,57.15 21.59,45.72 RP2.4
N$40
  Top 0.406: LED11.A 7.62,57.15 21.59,43.18 RP2.3
PDONE  (1 unrouted)
PFEED  (1 unrouted)
PHOLE1  (1 unrouted)
PHOLE2  (1 unrouted)
PHOLE3  (1 unrouted)
PHOLE4  (1 unrouted)
PHOLE5  (1 unrouted)
PHOLE6  (1 unrouted)
PHOLE7  (1 unrouted)
PHOLE8  (1 unrouted)
POWER  (1 unrouted)
PSYNC  (1 unrouted)
RDRON  (1 unrouted)
RFEED  (1 unrouted)
SCK  (2 unrouted)
  Top 0.406: SV1.4 80.65,38.73 88.9,38.73 U$2.A2
SCR  (1 unrouted)
SP
  Top 0.406: IC4.3 71.12,73.66 71.12,80.65 74.3,83.82 U$2.8
VCC  (2 unrouted)
  Top 0.61: IC8.4 115.57,74.93 IC9.8 | IC6.4 95.25,74.93 IC7.8 | 103.5,73.03 105.41,74.93 IC8.8 | 103.5,73.03 IC7.4 | IC1.8 35.56,81.28 C1.1 | IC1.4 43.18,71.12 RP1.1 | IC2.4 54.61,74.93 IC3.8 54.61,81.28 45.72,81.28 IC2.8 | C2.1 R5.2 62.23,38.1 IC3.4 63.5,73.66 63.5,78.74 IC4.8 | IC5.4 85.09,74.93 IC6.8 | IC4.4 74.93,74.93 IC5.8 | RP2.1 17.78,38.1 SV3.7 | SV1.7 103.5,57.79 103.5,73.03
  Bottom 0.61: IC9.4 121.92,73.66 114.3,73.66 IC8.4 | IC7.4 99.06,76.2 | 99.06,76.2 IC7.8 93.98,78.74 83.82,78.74 | IC9.8 111.76,76.2 99.06,76.2 | IC2.8 43.18,81.28 36.83,81.28 C1.1 | IC1.4 43.18,73.66 50.8,73.66 IC2.4 | 66.04,78.74 IC4.8 | 73.66,78.74 66.04,78.74 | IC5.8 73.66,78.74 | 83.82,78.74 IC6.8 | 73.66,78.74 83.82,78.74 | IC3.8 55.88,78.74 66.04,78.74 | U$2.5V0 68.58,38.1 R5.2

### Text on the board
tPlace: . | Paper | Tape | Reader | . | Paper | Tape | TR-02A | Reader